# Altium project solar_light.PrjPcb
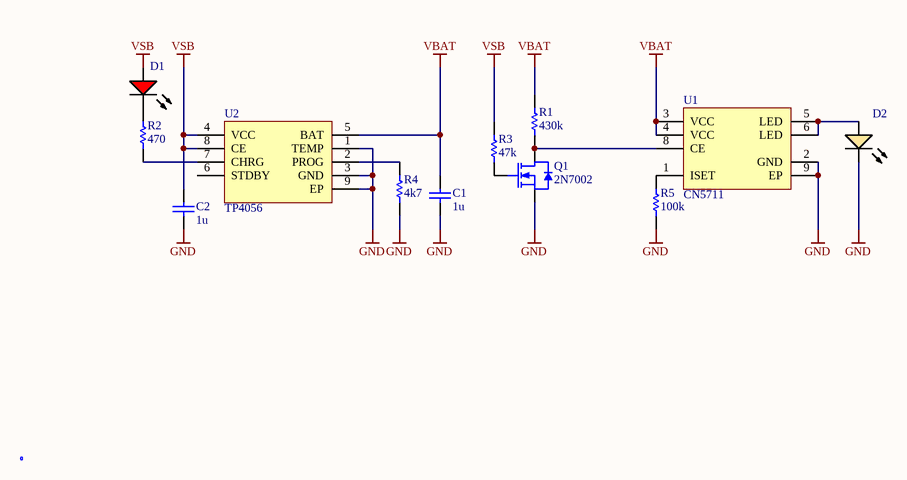
[diagram p0: main.SchDoc]
PRJ_ID: FS Ctrl; PRJ_VER: 2.0.0
1 sheet, 13 parts. Net scope: global (net labels, ports and power ports of the same name join across sheets).
Board file: board.PcbDoc

## Sheet main.SchDoc
size A4

### Parts
C1  1u  [C1206]
C2  1u  [C1206]
D1  RED  [LED-0603-RED]  (value not drawn)
D2  RED  [LED-1W]  (value not drawn)
LOGO1  LOGO  [LOGO]  (value not drawn)  (graphical)
Q1  2N7002  [SOT-23]
R1  430k  [R0603]
R2  470  [R0603]
R3  47k  [R0603]
R4  4k7  [R0603]
R5  100k  [R0603]
U1  CN5711  [PowerSOIC-8]
U2  TP4056  [PowerSOIC-8]

### Nets
GND: C1.1 C2.1 D2.2(K) Q1.2(SOURCE) R4.1 R5.1 U1.2(GND) U1.9(EP) U2.1(TEMP) U2.3(GND) U2.9(EP)
VBAT: C1.2 R1.1 U1.3(VCC) U1.4(VCC) U2.5(BAT)
VSB: C2.2 D1.1(A) R3.1 U2.4(VCC) U2.8(CE)
NetD1_2: D1.2(K) R2.2
NetD2_1: D2.1(A) U1.5(LED) U1.6(LED)
NetQ1_1: Q1.1(GATE) R3.2
NetQ1_3: Q1.3(DRAIN) R1.2 U1.8(CE)
NetR2_1: R2.1 U2.7(CHRG)
NetR4_2: R4.2 U2.2(PROG)
NetR5_2: R5.2 U1.1(ISET)

Not connected (* = marked no-connect by the designer): U2 6(STDBY)

### Library data of the parts
C1 C2 = Cap
D1 D2 = LED-0603-RED: LED 0603 RED
R1-R5 = Res1